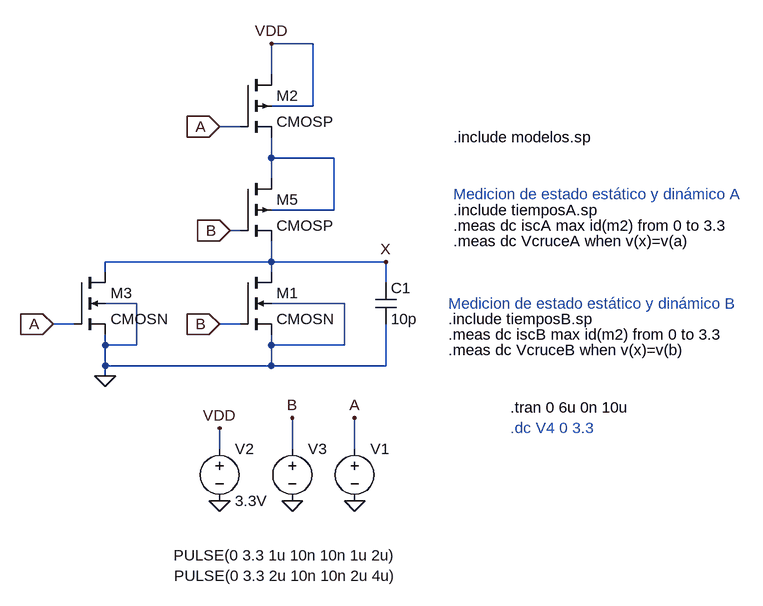
[diagram p0: schematic NOR_2pins_2mA_Correccion.asc]
NOR_2pins_2mA_Correccion.asc, the LTspice schematic file:
Version 4
SHEET 1 1484 824
WIRE 224 -256 160 -256
WIRE 160 -208 160 -256
WIRE 224 -160 224 -256
WIRE 224 -160 160 -160
WIRE 112 -128 80 -128
WIRE 160 -80 160 -112
WIRE 256 -80 160 -80
WIRE 160 -48 160 -80
WIRE 256 0 256 -80
WIRE 256 0 160 0
WIRE 112 32 96 32
WIRE 160 80 160 48
WIRE 160 80 -96 80
WIRE 336 80 160 80
WIRE -96 96 -96 80
WIRE 160 96 160 80
WIRE 336 112 336 80
WIRE -48 144 -96 144
WIRE 272 144 160 144
WIRE -144 176 -176 176
WIRE 112 176 80 176
WIRE -96 208 -96 192
WIRE -48 208 -48 144
WIRE -48 208 -96 208
WIRE 160 208 160 192
WIRE 272 208 272 144
WIRE 272 208 160 208
WIRE -96 240 -96 208
WIRE 160 240 160 208
WIRE 160 240 -96 240
WIRE 336 240 336 176
WIRE 336 240 160 240
WIRE -96 256 -96 240
WIRE 80 368 80 336
WIRE 192 368 192 320
WIRE 288 368 288 320
FLAG 80 336 VDD
FLAG 160 -256 VDD
FLAG 288 320 A
FLAG 80 -128 A
IOPIN 80 -128 In
FLAG 192 320 B
FLAG -176 176 A
IOPIN -176 176 In
FLAG 80 176 B
IOPIN 80 176 In
FLAG -96 256 0
FLAG 336 80 X
FLAG 80 448 0
FLAG 192 448 0
FLAG 288 448 0
FLAG 96 32 B
IOPIN 96 32 In
SYMBOL nmos4 112 96 R0
SYMATTR InstName M1
SYMATTR Value CMOSN
SYMATTR Value2 l=0.6u w=7.5u
SYMBOL pmos4 112 -208 R0
SYMATTR InstName M2
SYMATTR Value CMOSP
SYMATTR Value2 l=.6u w=26.1u
SYMBOL voltage 288 352 R0
WINDOW 3 -279 180 Left 2
WINDOW 123 0 0 Left 0
WINDOW 39 0 0 Left 0
SYMATTR Value PULSE(0 3.3 1u 10n 10n 1u 2u)
SYMATTR InstName V1
SYMBOL voltage 80 352 R0
WINDOW 123 0 0 Left 0
WINDOW 39 0 0 Left 0
SYMATTR InstName V2
SYMATTR Value 3.3V
SYMBOL cap 320 112 R0
SYMATTR InstName C1
SYMATTR Value 10p
SYMBOL nmos4 -144 96 R0
SYMATTR InstName M3
SYMATTR Value CMOSN
SYMATTR Value2 l=0.6u w=7.5u
SYMBOL voltage 192 352 R0
WINDOW 3 -182 211 Left 2
WINDOW 123 0 0 Left 0
WINDOW 39 0 0 Left 0
SYMATTR Value PULSE(0 3.3 2u 10n 10n 2u 4u)
SYMATTR InstName V3
SYMBOL pmos4 112 -48 R0
SYMATTR InstName M5
SYMATTR Value CMOSP
SYMATTR Value2 l=.6u w=26.1u
TEXT 440 -112 Left 2 !.include modelos.sp
TEXT 440 48 Left 2 !.meas dc VcruceA when v(x)=v(a)
TEXT 440 0 Left 2 !.include tiemposA.sp
TEXT 440 24 Left 2 !.meas dc iscA max id(m2) from 0 to 3.3
TEXT 440 -24 Left 2 ;Medicion de estado estático y dinámico A
TEXT 432 216 Left 2 !.meas dc VcruceB when v(x)=v(b)
TEXT 432 192 Left 2 !.meas dc iscB max id(m2) from 0 to 3.3
TEXT 432 144 Left 2 ;Medicion de estado estático y dinámico B
TEXT 432 168 Left 2 !.include tiemposB.sp
TEXT 528 304 Left 2 !.tran 0 6u 0n 10u
TEXT 528 336 Left 2 ;.dc V4 0 3.3

The netlist it stands for:
* NOR_2pins_2mA_Correccion.asc
M1 X B 0 0 CMOSN l=0.6u w=7.5u
M2 VDD A N001 VDD CMOSP l=.6u w=26.1u
V1 A 0 PULSE(0 3.3 1u 10n 10n 1u 2u)
V2 VDD 0 3.3V
C1 X 0 10p
M3 X A 0 0 CMOSN l=0.6u w=7.5u
V3 B 0 PULSE(0 3.3 2u 10n 10n 2u 4u)
M5 N001 B X N001 CMOSP l=.6u w=26.1u
.model NMOS NMOS
.model PMOS PMOS
.lib standard.mos
.include modelos.sp
.meas dc VcruceA when v(x)=v(a)
.include tiemposA.sp
.meas dc iscA max id(m2) from 0 to 3.3
* Medicion de estado estático y dinámico A
.meas dc VcruceB when v(x)=v(b)
.meas dc iscB max id(m2) from 0 to 3.3
* Medicion de estado estático y dinámico B
.include tiemposB.sp
.tran 0 6u 0n 10u
* .dc V4 0 3.3
.backanno
.end

* Results of the author's LTspice run, read from the files saved beside the schematic
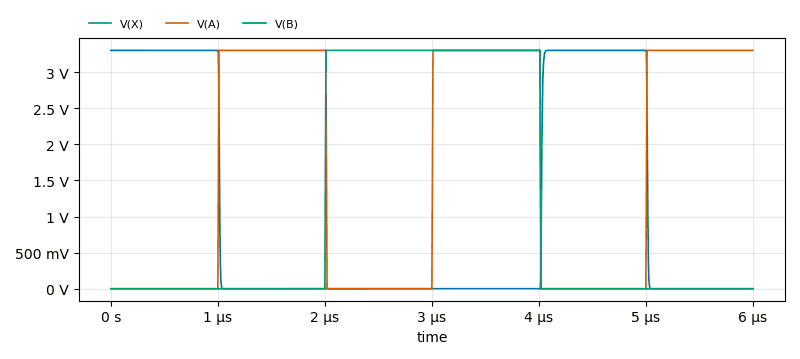
[diagram p1: Transient Analysis of NOR_2pins_2mA_Correccion.asc, plotted from the saved traces]
* Transient Analysis, 1 run:
*   V(X): min -892.2 µV, max 3.3 V, average 1.102 V, rms 1.901 V, last 331.2 nV
*   V(A): min 0 V, max 3.3 V, average 1.658 V, rms 2.336 V, last 3.3 V
*   V(B): min 0 V, max 3.3 V, average 1.105 V, rms 1.908 V, last 0 V